# EAGLE design PokeDuino (EAGLE 6.2)
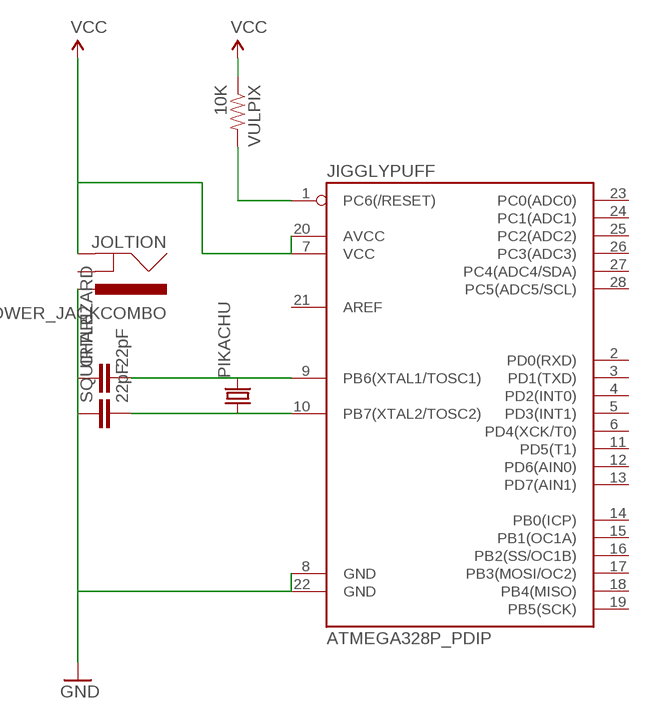
[diagram p0: schematic, sheet 1]

## Parts
CHARIZARD  22pF  CAPPTH1  [CAP-PTH-5MM]
JIGGLYPUFF  ATMEGA328P_PDIP  [DIL28-3]
JOLTION  POWER_JACKCOMBO  [POWER_JACK_COMBO]
PIKACHU  CRYSTALHC49UV  [HC49U-V]
SQUIRTLE  22pF  CAPPTH1  [CAP-PTH-5MM]
VULPIX  10K  RESISTORPTH-1/4W  [AXIAL-0.4]

## Nets
N$2: JIGGLYPUFF.10(PB7(XTAL2/TOSC2)) PIKACHU.1 SQUIRTLE.2
N$4: JIGGLYPUFF.1(PC6(/RESET)) VULPIX.P$2
N$8: CHARIZARD.1 JIGGLYPUFF.8(GND) JIGGLYPUFF.22(GND) JOLTION.POWER(PWR) SQUIRTLE.1 ; supply symbol labelled GND
N$11: CHARIZARD.2 JIGGLYPUFF.9(PB6(XTAL1/TOSC1)) PIKACHU.2
VCC: JIGGLYPUFF.7(VCC) JIGGLYPUFF.20(AVCC) JOLTION.GND@1(GND) VULPIX.P$1
Unconnected: JIGGLYPUFF.2(PD0(RXD)) JIGGLYPUFF.3(PD1(TXD)) JIGGLYPUFF.4(PD2(INT0)) JIGGLYPUFF.5(PD3(INT1)) JIGGLYPUFF.6(PD4(XCK/T0)) JIGGLYPUFF.11(PD5(T1)) JIGGLYPUFF.12(PD6(AIN0)) JIGGLYPUFF.13(PD7(AIN1)) JIGGLYPUFF.14(PB0(ICP)) JIGGLYPUFF.15(PB1(OC1A)) JIGGLYPUFF.16(PB2(SS/OC1B)) JIGGLYPUFF.17(PB3(MOSI/OC2)) JIGGLYPUFF.18(PB4(MISO)) JIGGLYPUFF.19(PB5(SCK)) JIGGLYPUFF.21(AREF) JIGGLYPUFF.23(PC0(ADC0)) JIGGLYPUFF.24(PC1(ADC1)) JIGGLYPUFF.25(PC2(ADC2)) JIGGLYPUFF.26(PC3(ADC3)) JIGGLYPUFF.27(PC4(ADC4/SDA)) JIGGLYPUFF.28(PC5(ADC5/SCL)) JOLTION.GND(GNDBREAK)

## Library data of the parts
CHARIZARD SQUIRTLE = SparkFun:CAP: Capacitor Standard 0603 ceramic capacitor, and 0.1" leaded capacitor.
JIGGLYPUFF = SparkFun-DigitalIC:ATMEGA328P_PDIP: uC used in the Arduino 32kb flash, 1k EEPROM, 2k SRAM This is the through-hole version of this chip.
JOLTION = SparkFun-Connectors:POWER_JACK: Power Jack This is the standard 5.5mm barrel jack for power. The PTH is the most common, proven, reliable, footprint. The Slot footprint only works if the mill layer is transmitted to the PCB fab house so be warned. Mating wall wart : TOL-00298 (and others)
PIKACHU = SparkFun:CRYSTAL: Crystals Various standard crystals. Proven footprints. Spark Fun Electronics SKU : COM-00534
VULPIX = SparkFun-Resistors:RESISTOR: Resistor Basic schematic elements and footprints for 0603, 1206, and PTH resistors.

## Board
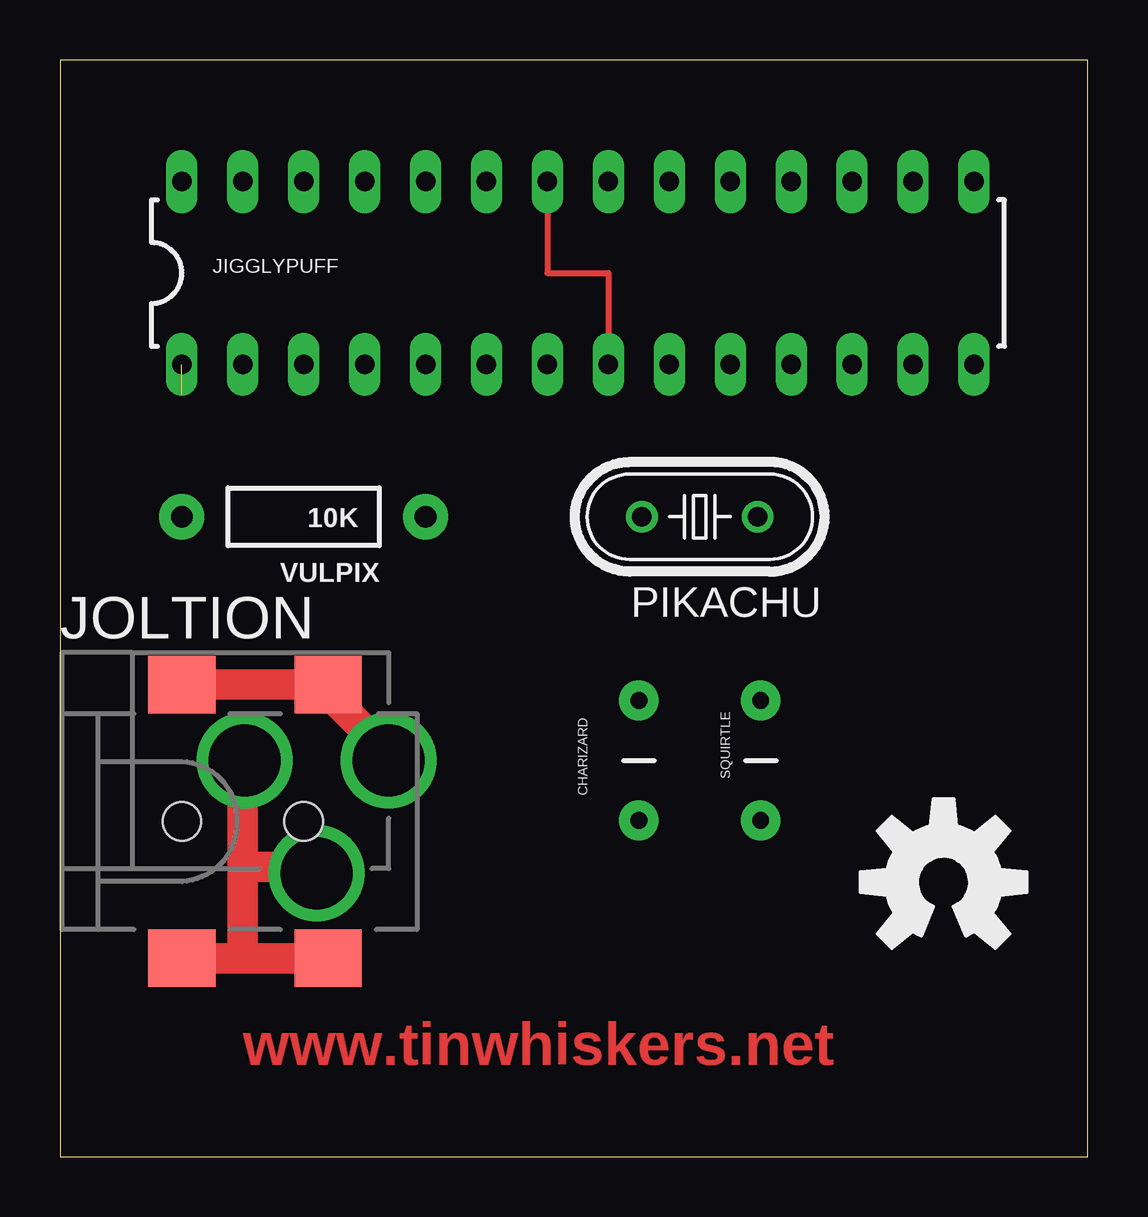
[diagram p1: board, top side]
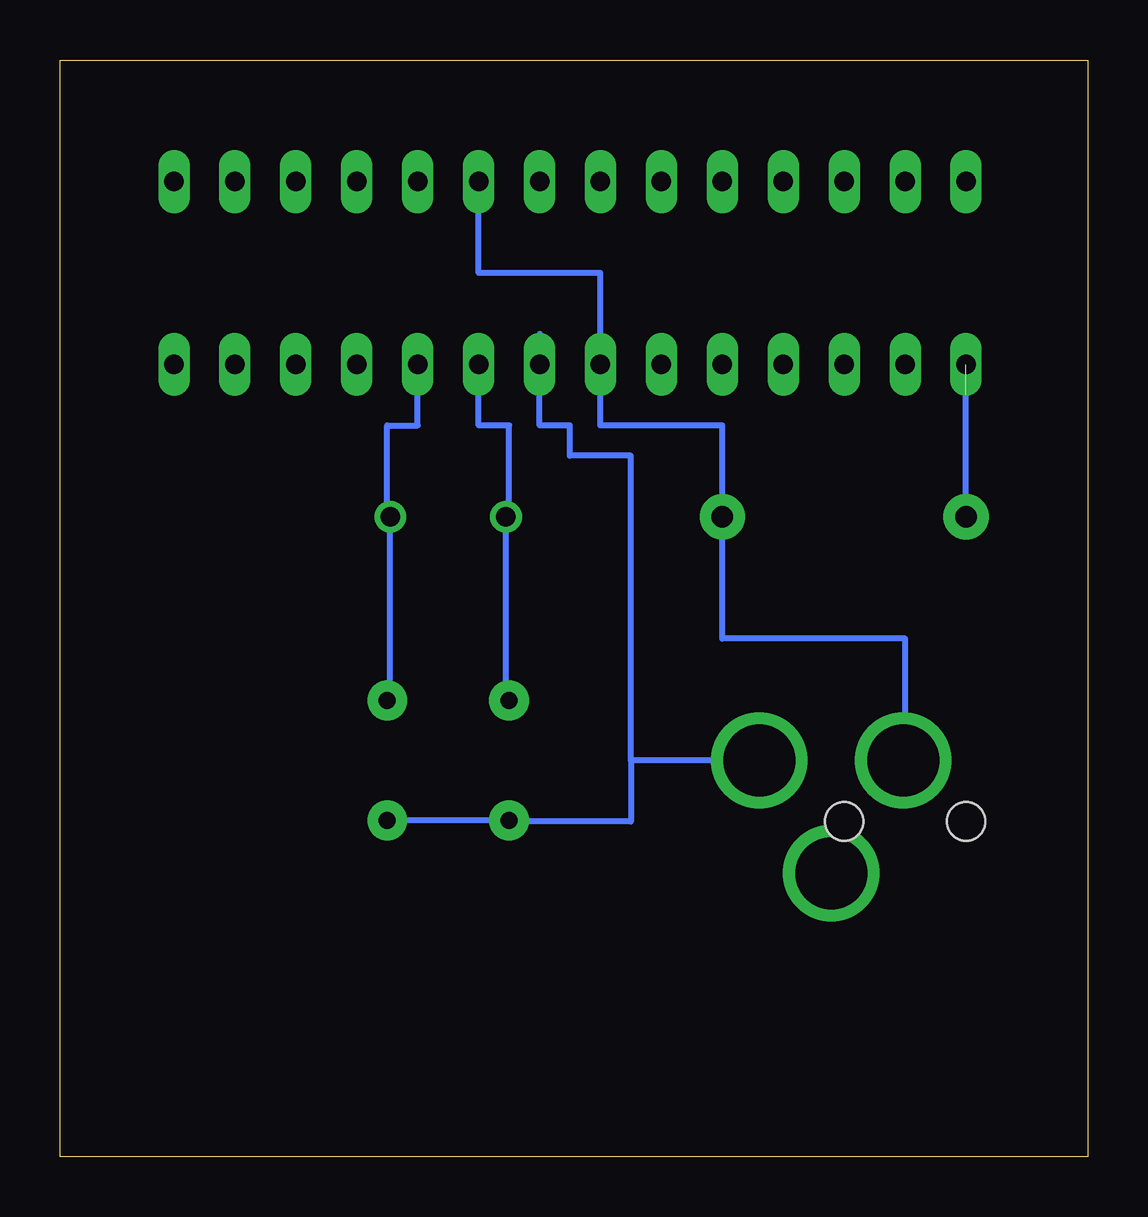
[diagram p2: board, bottom side, seen from below]

Size 42.85 x 45.71 mm. Coordinates in mm from the lower left corner, seen from the top.
Outline: 0,0 42.85,0 42.85,45.71 0,45.71 0,0
Copper layers (1*16): Top 0.035mm / dielectric 1.5mm / Bottom 0.035mm
Design rules: minimum track width 10mil, minimum drill 24mil, track to track 8mil, track to pad 8mil, pad to pad 8mil, via to via 8mil, smd to smd 8mil, copper to edge 40mil, drill to drill 8mil, minimum pad ring 10mil, minimum via ring 8mil, stop-mask expansion 4mil, vias tented up to drill 0mil, thermal gap 10mil

### Footprints (pad centres in the part's own frame; a part is rotated, then mirrored left to right if it is on the bottom)
CAP-PTH-5MM = drill 0.7 pad 1.651: 1 -2.5,0; 2 2.5,0
DIL28-3 = drill 0.813 long: 1 -16.51,-3.81; 2 -13.97,-3.81; 3 -11.43,-3.81; 4 -8.89,-3.81; 5 -6.35,-3.81; 6 -3.81,-3.81; 7 -1.27,-3.81; 8 1.27,-3.81; 9 3.81,-3.81; 10 6.35,-3.81; 11 8.89,-3.81; 12 11.43,-3.81; 13 13.97,-3.81; 14 16.51,-3.81; 15 16.51,3.81; 16 13.97,3.81; 17 11.43,3.81; 18 8.89,3.81; 19 6.35,3.81; 20 3.81,3.81; 21 1.27,3.81; 22 -1.27,3.81; 23 -3.81,3.81; 24 -6.35,3.81; 25 -8.89,3.81; 26 -11.43,3.81; 27 -13.97,3.81; 28 -16.51,3.81
POWER_JACK_COMBO = drill 2.997: GND 5.62,-2.16; GND@1 2.62,2.54; POWER 8.62,2.54 | smd 2.8 x 2.4: GND@3 0,-5.7; GND@4 6.1,-5.7; POWER@1 0,5.7; POWER@2 6.1,5.7 | hole 1.6: 0,0; 5.08,0
HC49U-V = drill 0.813: 1 -2.413,0; 2 2.413,0
AXIAL-0.4 = drill 0.9 pad 1.88: P$1 -5.08,0; P$2 5.08,0

### Placement (x,y rotation side)
CHARIZARD  24.13,16.51 90 top
JIGGLYPUFF  21.59,36.83 0 top
JOLTION  5.08,13.97 0 top
PIKACHU  26.67,26.67 180 top
SQUIRTLE  29.21,16.51 90 top
U$1  [OSHW-LOGO-L]  36.83,11.43 0 top
VULPIX  10.16,26.67 180 top

### Tracks (layer width: path | path; a pad name or v marks a point on that pad's centre or on a via)
N$2
  Bottom 0.254: SQUIRTLE.2 29.08,19.01 PIKACHU.1 29.21,26.67 29.21,30.48 27.94,30.48 JIGGLYPUFF.10
N$4  (1 unrouted)
  Bottom 0.254: VULPIX.P$2 5.08,31.75
N$8
  Top 0.254: JIGGLYPUFF.22 20.32,36.83 22.86,36.83 JIGGLYPUFF.8
  Bottom 0.254: 19.05,16.51 19.05,29.21 21.59,29.21 21.59,30.48 22.86,30.48 JIGGLYPUFF.8 22.86,34.29 | JOLTION.POWER 19.05,16.51 | 19.05,16.51 19.05,13.97 24.13,13.97 CHARIZARD.1 SQUIRTLE.1
N$11
  Bottom 0.254: CHARIZARD.2 24.26,19.01 PIKACHU.2 24.13,26.67 24.13,30.48 25.4,30.48 JIGGLYPUFF.9
VCC
  Bottom 0.254: JOLTION.GND@1 7.62,16.51 7.62,21.59 15.24,21.59 VULPIX.P$1 15.24,30.48 20.32,30.48 JIGGLYPUFF.7 20.32,36.83 25.4,36.83 JIGGLYPUFF.20

### Text on the board
Top: www.tinwhiskers.net